# Altium schematic sheet InterfacesB_RGMII_Ethernet.SchDoc
size A4; DocumentNumber: 8; SheetNumber: 8
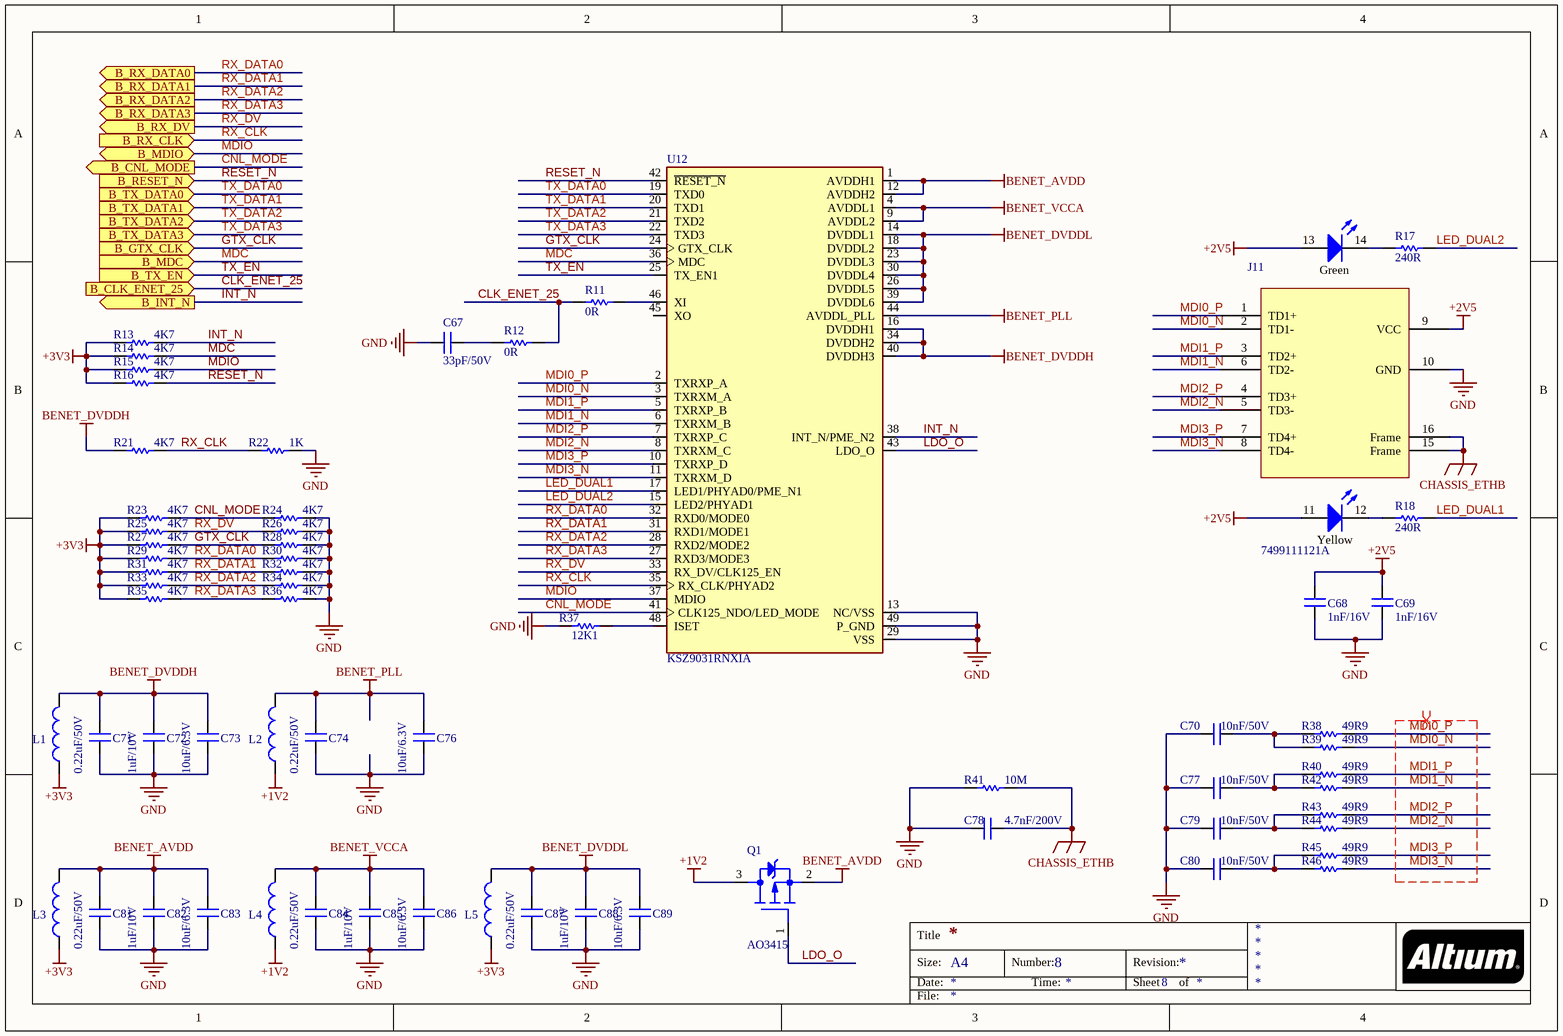
[diagram p0: InterfacesB_RGMII_Ethernet.SchDoc]

## Parts
C67  value 33pF/50V  [CAP_0805]  (hidden comment: CAP_0805)
C68  value 1nF/16V  [CAP_0805]  (hidden comment: CAP_0805)
C69  value 1nF/16V  [CAP_0805]  (hidden comment: CAP_0805)
C70  value 10nF/50V  [CAP_0805]  (hidden comment: CAP_0805)
C71  value 0.22uF/50V  [CAP_0805]  (hidden comment: CAP_0805)
C72  value 1uF/10V  [CAP_0805]  (hidden comment: CAP_0805)
C73  value 10uF/6.3V  [CAP_0805]  (hidden comment: CAP_0805)
C74  value 0.22uF/50V  [CAP_0805]  (hidden comment: CAP_0805)
C76  value 10uF/6.3V  [CAP_0805]  (hidden comment: CAP_0805)
C77  value 10nF/50V  [CAP_0805]  (hidden comment: CAP_0805)
C78  value 4.7nF/200V  [CAP_0805]  (hidden comment: CAP_0805)
C79  value 10nF/50V  [CAP_0805]  (hidden comment: CAP_0805)
C80  value 10nF/50V  [CAP_0805]  (hidden comment: CAP_0805)
C81  value 0.22uF/50V  [CAP_0805]  (hidden comment: CAP_0805)
C82  value 1uF/10V  [CAP_0805]  (hidden comment: CAP_0805)
C83  value 10uF/6.3V  [CAP_0805]  (hidden comment: CAP_0805)
C84  value 0.22uF/50V  [CAP_0805]  (hidden comment: CAP_0805)
C85  value 1uF/10V  [CAP_0805]  (hidden comment: CAP_0805)
C86  value 10uF/6.3V  [CAP_0805]  (hidden comment: CAP_0805)
C87  value 0.22uF/50V  [CAP_0805]  (hidden comment: CAP_0805)
C88  value 1uF/10V  [CAP_0805]  (hidden comment: CAP_0805)
C89  value 10uF/6.3V  [CAP_0805]  (hidden comment: CAP_0805)
J11  7499111121A  [7499111121A]
L1  IND_0805  [IND_0805]  (value not drawn)
L2  IND_0805  [IND_0805]  (value not drawn)
L3  IND_0805  [IND_0805]  (value not drawn)
L4  IND_0805  [IND_0805]  (value not drawn)
L5  IND_0805  [IND_0805]  (value not drawn)
Q1  AO3415  [AO3415]
R11  value 0R  [RES_0805]  (hidden comment: RES_0805)
R12  value 0R  [RES_0805]  (hidden comment: RES_0805)
R13  value 4K7  [RES_0805]  (hidden comment: RES_0805)
R14  value 4K7  [RES_0805]  (hidden comment: RES_0805)
R15  value 4K7  [RES_0805]  (hidden comment: RES_0805)
R16  value 4K7  [RES_0805]  (hidden comment: RES_0805)
R17  value 240R  [RES_0805]  (hidden comment: RES_0805)
R18  value 240R  [RES_0805]  (hidden comment: RES_0805)
R21  value 4K7  [RES_0805]  (hidden comment: RES_0805)
R22  value 1K  [RES_0805]  (hidden comment: RES_0805)
R23  value 4K7  [RES_0805]  (hidden comment: RES_0805)
R24  value 4K7  [RES_0805]  (hidden comment: RES_0805)
R25  value 4K7  [RES_0805]  (hidden comment: RES_0805)
R26  value 4K7  [RES_0805]  (hidden comment: RES_0805)
R27  value 4K7  [RES_0805]  (hidden comment: RES_0805)
R28  value 4K7  [RES_0805]  (hidden comment: RES_0805)
R29  value 4K7  [RES_0805]  (hidden comment: RES_0805)
R30  value 4K7  [RES_0805]  (hidden comment: RES_0805)
R31  value 4K7  [RES_0805]  (hidden comment: RES_0805)
R32  value 4K7  [RES_0805]  (hidden comment: RES_0805)
R33  value 4K7  [RES_0805]  (hidden comment: RES_0805)
R34  value 4K7  [RES_0805]  (hidden comment: RES_0805)
R35  value 4K7  [RES_0805]  (hidden comment: RES_0805)
R36  value 4K7  [RES_0805]  (hidden comment: RES_0805)
R37  value 12K1  [RES_0805]  (hidden comment: RES_0805)
R38  value 49R9  [RES_0805]  (hidden comment: RES_0805)
R39  value 49R9  [RES_0805]  (hidden comment: RES_0805)
R40  value 49R9  [RES_0805]  (hidden comment: RES_0805)
R41  value 10M  [RES_0805]  (hidden comment: RES_0805)
R42  value 49R9  [RES_0805]  (hidden comment: RES_0805)
R43  value 49R9  [RES_0805]  (hidden comment: RES_0805)
R44  value 49R9  [RES_0805]  (hidden comment: RES_0805)
R45  value 49R9  [RES_0805]  (hidden comment: RES_0805)
R46  value 49R9  [RES_0805]  (hidden comment: RES_0805)
U12  KSZ9031RNXIA  [KSZ9031RNXIA]

## Ports
B_CLK_ENET_25 (in), B_CNL_MODE (out), B_GTX_CLK (in), B_INT_N (out), B_MDC (in), B_MDIO (bidir), B_RESET_N (in), B_RX_CLK (in), B_RX_DATA0 (out), B_RX_DATA1 (out), B_RX_DATA2 (out), B_RX_DATA3 (out), B_RX_DV (out), B_TX_DATA0 (in), B_TX_DATA1 (in), B_TX_DATA2 (in), B_TX_DATA3 (in), B_TX_EN (in)

## Nets
+1V2: L2.1 L4.1 Q1.3(D)
+2V5: C68.2 C69.2 J11.9(VCC) J11.11(A) J11.13(A)
+3V3: L1.1 L3.1 L5.1 R13.2 R14.2 R15.2 R16.2 R23.2 R25.2 R27.2 R29.2 R31.2 R33.2 R35.2
BENET_AVDD: C81.2 C82.2 C83.2 L3.2 Q1.2(S) U12.1(AVDDH1) U12.12(AVDDH2)
BENET_DVDDH: C71.2 C72.2 C73.2 L1.2 R21.2 U12.16(DVDDH1) U12.34(DVDDH2) U12.40(DVDDH3)
BENET_DVDDL: C87.2 C88.2 C89.2 L5.2 U12.14(DVDDL1) U12.18(DVDDL2) U12.23(DVDDL3) U12.26(DVDDL5) U12.30(DVDDL4) U12.39(DVDDL6)
BENET_PLL: C74.2 C76.2 L2.2 U12.44(AVDDL_PLL)
BENET_VCCA: C84.2 C85.2 C86.2 L4.2 U12.4(AVDDL1) U12.9(AVDDL2)
CHASSIS_ETHB: C78.1 J11.15(Frame) J11.16(Frame) R41.1
GND: C67.2 C68.1 C69.1 C70.2 C71.1 C72.1 C73.1 C74.1 C76.1 C77.2 C78.2 C79.2 C80.2 C81.1 C82.1 C83.1 C84.1 C85.1 C86.1 C87.1 C88.1 C89.1 J11.10(GND) R22.1 R24.1 R26.1 R28.1 R30.1 R32.1 R34.1 R36.1 R37.1 R41.2 U12.13(NC/VSS) U12.29(VSS) U12.49(P_GND)
CLK_ENET_25: R11.2 R12.2 ; port B_CLK_ENET_25
CNL_MODE: R23.1 R24.2 U12.41(CLK125_NDO/LED_MODE) ; port B_CNL_MODE
GTX_CLK: R27.1 R28.2 U12.24(GTX_CLK) ; port B_GTX_CLK
INT_N: R13.1 U12.38(INT_N/PME_N2) ; port B_INT_N
LDO_O: Q1.1(G) U12.43(LDO_O)
LED_DUAL1: R18.2 U12.17(LED1/PHYAD0/PME_N1)
LED_DUAL2: R17.2 U12.15(LED2/PHYAD1)
MDC: R14.1 U12.36(MDC) ; port B_MDC
MDI0_N: J11.2(TD1-) R39.2 U12.3(TXRXM_A)
MDI0_P: J11.1(TD1+) R38.2 U12.2(TXRXP_A)
MDI1_N: J11.6(TD2-) R42.2 U12.6(TXRXM_B)
MDI1_P: J11.3(TD2+) R40.2 U12.5(TXRXP_B)
MDI2_N: J11.5(TD3-) R44.2 U12.8(TXRXM_C)
MDI2_P: J11.4(TD3+) R43.2 U12.7(TXRXP_C)
MDI3_N: J11.8(TD4-) R46.2 U12.11(TXRXM_D)
MDI3_P: J11.7(TD4+) R45.2 U12.10(TXRXP_D)
MDIO: R15.1 U12.37(MDIO) ; port B_MDIO
RESET_N: R16.1 U12.42(~{RESET_N}) ; port B_RESET_N
RX_CLK: R21.1 R22.2 U12.35(RX_CLK/PHYAD2) ; port B_RX_CLK
RX_DATA0: R29.1 R30.2 U12.32(RXD0/MODE0) ; port B_RX_DATA0
RX_DATA1: R31.1 R32.2 U12.31(RXD1/MODE1) ; port B_RX_DATA1
RX_DATA2: R33.1 R34.2 U12.28(RXD2/MODE2) ; port B_RX_DATA2
RX_DATA3: R35.1 R36.2 U12.27(RXD3/MODE3) ; port B_RX_DATA3
RX_DV: R25.1 R26.2 U12.33(RX_DV/CLK125_EN) ; port B_RX_DV
TX_DATA0: U12.19(TXD0) ; port B_TX_DATA0
TX_DATA1: U12.20(TXD1) ; port B_TX_DATA1
TX_DATA2: U12.21(TXD2) ; port B_TX_DATA2
TX_DATA3: U12.22(TXD3) ; port B_TX_DATA3
TX_EN: U12.25(TX_EN1) ; port B_TX_EN
NetC67_1: C67.1 R12.1
NetC70_1: C70.1 R38.1 R39.1
NetC77_1: C77.1 R40.1 R42.1
NetC79_1: C79.1 R43.1 R44.1
NetC80_1: C80.1 R45.1 R46.1
NetJ11_12: J11.12(K) R18.1
NetJ11_14: J11.14(K) R17.1
NetR11_1: R11.1 U12.46(XI)
NetR37_2: R37.2 U12.48(ISET)

Not connected (* = marked no-connect by the designer): U12 45(XO)

## Layout directives
differential pair: MDI0_N, MDI0_P, MDI1_N, MDI1_P, MDI2_N, MDI2_P, MDI3_N, MDI3_P

## Notes on the sheet
- Title
- Size:
- Date:
- A4
- Number:
- Time:
- Revision:
- Sheet
- of
- File:
- (in symbol 7499111121A) Green; Yellow

## Library data of the parts
Q1 = AO3415: 20V P-Channel MOSFET
U12 = KSZ9031RNXIA: 4/4 Transceiver Full Ethernet 48-QFN _7x7_; MF: Microchip; MP: KSZ9031RNXIA; Digi-Key_Purchase_URL: https://www.digikey.pk/product-detail/en/microchip-technology/KSZ9031RNXIA-TR/KSZ9031RNXIA-TR-ND/3925129?utm_source=snapeda&utm_medium=aggregator&utm_campaign=symbol; Package: QFN-48 Microchip; SnapEDA_Link: https://www.snapeda.com/parts/KSZ9031RNXIA/Microchip/view-part/378526/?ref=snap; Value: *; Digi-Key_Part_Number: KSZ9031RNXIA-TR-ND
J11 = 7499111121A: Supplier 1: Digi-Key; Supplier Part Number 1: 1297-1070-5-ND